# Altium schematic sheet Gate_Drive.SchDoc
size A4; SheetNumber: 2; SheetTotal: 3
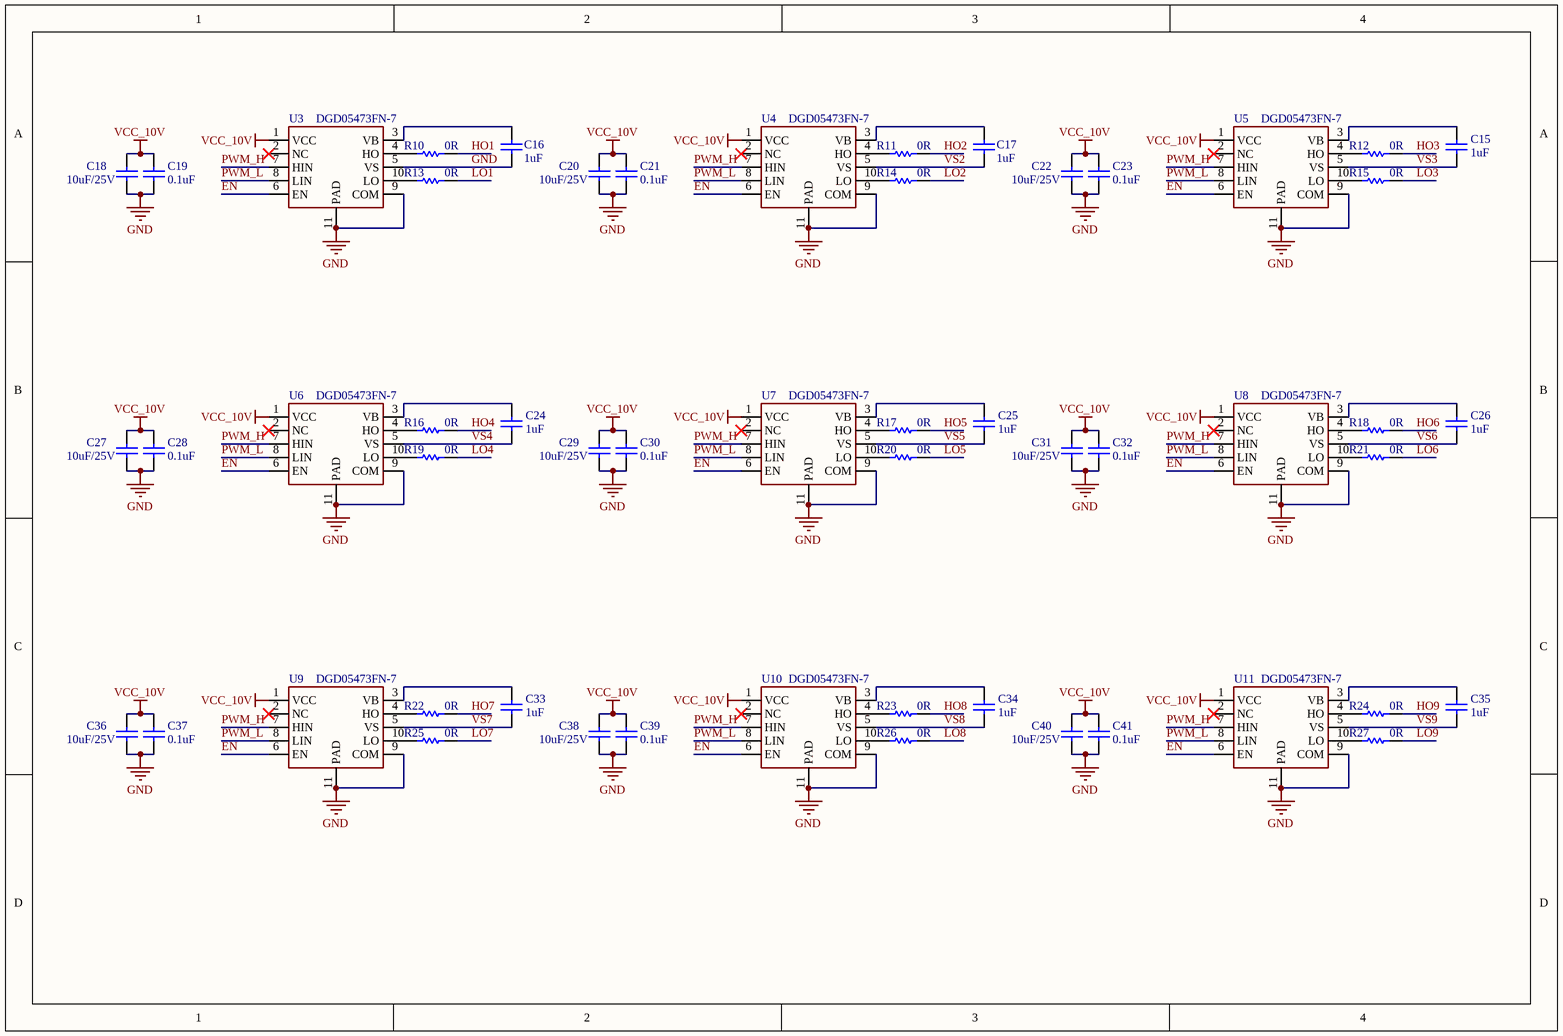
[diagram p0: Gate_Drive.SchDoc]

## Parts
C15  1uF  [C0603_M]
C16  1uF  [C0603_M]
C17  1uF  [C0603_M]
C18  10uF/25V  [C0603_M]
C19  0.1uF  [C0603_M]
C20  10uF/25V  [C0603_M]
C21  0.1uF  [C0603_M]
C22  10uF/25V  [C0603_M]
C23  0.1uF  [C0603_M]
C24  1uF  [C0603_M]
C25  1uF  [C0603_M]
C26  1uF  [C0603_M]
C27  10uF/25V  [C0603_M]
C28  0.1uF  [C0603_M]
C29  10uF/25V  [C0603_M]
C30  0.1uF  [C0603_M]
C31  10uF/25V  [C0603_M]
C32  0.1uF  [C0603_M]
C33  1uF  [C0603_M]
C34  1uF  [C0603_M]
C35  1uF  [C0603_M]
C36  10uF/25V  [C0603_M]
C37  0.1uF  [C0603_M]
C38  10uF/25V  [C0603_M]
C39  0.1uF  [C0603_M]
C40  10uF/25V  [C0603_M]
C41  0.1uF  [C0603_M]
R10  0R  [R0603_M]
R11  0R  [R0603_M]
R12  0R  [R0603_M]
R13  0R  [R0603_M]
R14  0R  [R0603_M]
R15  0R  [R0603_M]
R16  0R  [R0603_M]
R17  0R  [R0603_M]
R18  0R  [R0603_M]
R19  0R  [R0603_M]
R20  0R  [R0603_M]
R21  0R  [R0603_M]
R22  0R  [R0603_M]
R23  0R  [R0603_M]
R24  0R  [R0603_M]
R25  0R  [R0603_M]
R26  0R  [R0603_M]
R27  0R  [R0603_M]
U3  DGD05473FN-7  [W-DFN3030-10_L3.0-W3.0-P0.50-BL-EP]
U4  DGD05473FN-7  [W-DFN3030-10_L3.0-W3.0-P0.50-BL-EP]
U5  DGD05473FN-7  [W-DFN3030-10_L3.0-W3.0-P0.50-BL-EP]
U6  DGD05473FN-7  [W-DFN3030-10_L3.0-W3.0-P0.50-BL-EP]
U7  DGD05473FN-7  [W-DFN3030-10_L3.0-W3.0-P0.50-BL-EP]
U8  DGD05473FN-7  [W-DFN3030-10_L3.0-W3.0-P0.50-BL-EP]
U9  DGD05473FN-7  [W-DFN3030-10_L3.0-W3.0-P0.50-BL-EP]
U10  DGD05473FN-7  [W-DFN3030-10_L3.0-W3.0-P0.50-BL-EP]
U11  DGD05473FN-7  [W-DFN3030-10_L3.0-W3.0-P0.50-BL-EP]

## Nets
GND: C16.1 C18.2 C19.2 C20.2 C21.2 C22.2 C23.2 C27.2 C28.2 C29.2 C30.2 C31.2 C32.2 C36.2 C37.2 C38.2 C39.2 C40.2 C41.2 U3.5(VS) U3.9(COM) U3.11(PAD) U4.9(COM) U4.11(PAD) U5.9(COM) U5.11(PAD) U6.9(COM) U6.11(PAD) U7.9(COM) U7.11(PAD) U8.9(COM) U8.11(PAD) U9.9(COM) U9.11(PAD) U10.9(COM) U10.11(PAD) U11.9(COM) U11.11(PAD)
VCC_10V: C18.1 C19.1 C20.1 C21.1 C22.1 C23.1 C27.1 C28.1 C29.1 C30.1 C31.1 C32.1 C36.1 C37.1 C38.1 C39.1 C40.1 C41.1 U3.1(VCC) U4.1(VCC) U5.1(VCC) U6.1(VCC) U7.1(VCC) U8.1(VCC) U9.1(VCC) U10.1(VCC) U11.1(VCC)
EN: U3.6(EN) U4.6(EN) U5.6(EN) U6.6(EN) U7.6(EN) U8.6(EN) U9.6(EN) U10.6(EN) U11.6(EN)
HO1: R10.2
HO2: R11.2
HO3: R12.2
HO4: R16.2
HO5: R17.2
HO6: R18.2
HO7: R22.2
HO8: R23.2
HO9: R24.2
LO1: R13.2
LO2: R14.2
LO3: R15.2
LO4: R19.2
LO5: R20.2
LO6: R21.2
LO7: R25.2
LO8: R26.2
LO9: R27.2
PWM_H: U3.7(HIN) U4.7(HIN) U5.7(HIN) U6.7(HIN) U7.7(HIN) U8.7(HIN) U9.7(HIN) U10.7(HIN) U11.7(HIN)
PWM_L: U3.8(LIN) U4.8(LIN) U5.8(LIN) U6.8(LIN) U7.8(LIN) U8.8(LIN) U9.8(LIN) U10.8(LIN) U11.8(LIN)
VS2: C17.1 U4.5(VS)
VS3: C15.1 U5.5(VS)
VS4: C24.1 U6.5(VS)
VS5: C25.1 U7.5(VS)
VS6: C26.1 U8.5(VS)
VS7: C33.1 U9.5(VS)
VS8: C34.1 U10.5(VS)
VS9: C35.1 U11.5(VS)
NetC15_2: C15.2 U5.3(VB)
NetC16_2: C16.2 U3.3(VB)
NetC17_2: C17.2 U4.3(VB)
NetC24_2: C24.2 U6.3(VB)
NetC25_2: C25.2 U7.3(VB)
NetC26_2: C26.2 U8.3(VB)
NetC33_2: C33.2 U9.3(VB)
NetC34_2: C34.2 U10.3(VB)
NetC35_2: C35.2 U11.3(VB)
NetR10_1: R10.1 U3.4(HO)
NetR11_1: R11.1 U4.4(HO)
NetR12_1: R12.1 U5.4(HO)
NetR13_1: R13.1 U3.10(LO)
NetR14_1: R14.1 U4.10(LO)
NetR15_1: R15.1 U5.10(LO)
NetR16_1: R16.1 U6.4(HO)
NetR17_1: R17.1 U7.4(HO)
NetR18_1: R18.1 U8.4(HO)
NetR19_1: R19.1 U6.10(LO)
NetR20_1: R20.1 U7.10(LO)
NetR21_1: R21.1 U8.10(LO)
NetR22_1: R22.1 U9.4(HO)
NetR23_1: R23.1 U10.4(HO)
NetR24_1: R24.1 U11.4(HO)
NetR25_1: R25.1 U9.10(LO)
NetR26_1: R26.1 U10.10(LO)
NetR27_1: R27.1 U11.10(LO)

Not connected (* = marked no-connect by the designer): U3 2(NC)*; U4 2(NC)*; U5 2(NC)*; U6 2(NC)*; U7 2(NC)*; U8 2(NC)*; U9 2(NC)*; U10 2(NC)*; U11 2(NC)*

## Library data of the parts
C15-C17 C24-C26 C33-C35 = Cap: Capacitor; Published: 8-Jun-2000; LatestRevisionDate: 17-Jul-2002; LatestRevisionNote: Re-released for DXP Platform.; PackageReference: RAD-0.3; Publisher: Altium Limited; PackageDescription: Radial Cap, Thru-Hole; 2 Leads; 0.3 in Pin Spacing; Value: 1uF
C18-C23 C27-C32 C36-C41 = Cap: Capacitor; Value: 1uF; Published: 8-Jun-2000; LatestRevisionDate: 17-Jul-2002; LatestRevisionNote: Re-released for DXP Platform.; PackageReference: RAD-0.3; Publisher: Altium Limited; PackageDescription: Radial Cap, Thru-Hole; 2 Leads; 0.3 in Pin Spacing
R10-R27 = Res1: Resistor
U3-U11 = DGD05473